# EAGLE design PCB-Logic-1.1-in-wall-IoT-Switch-Logic-Board (EAGLE 7.4.0)
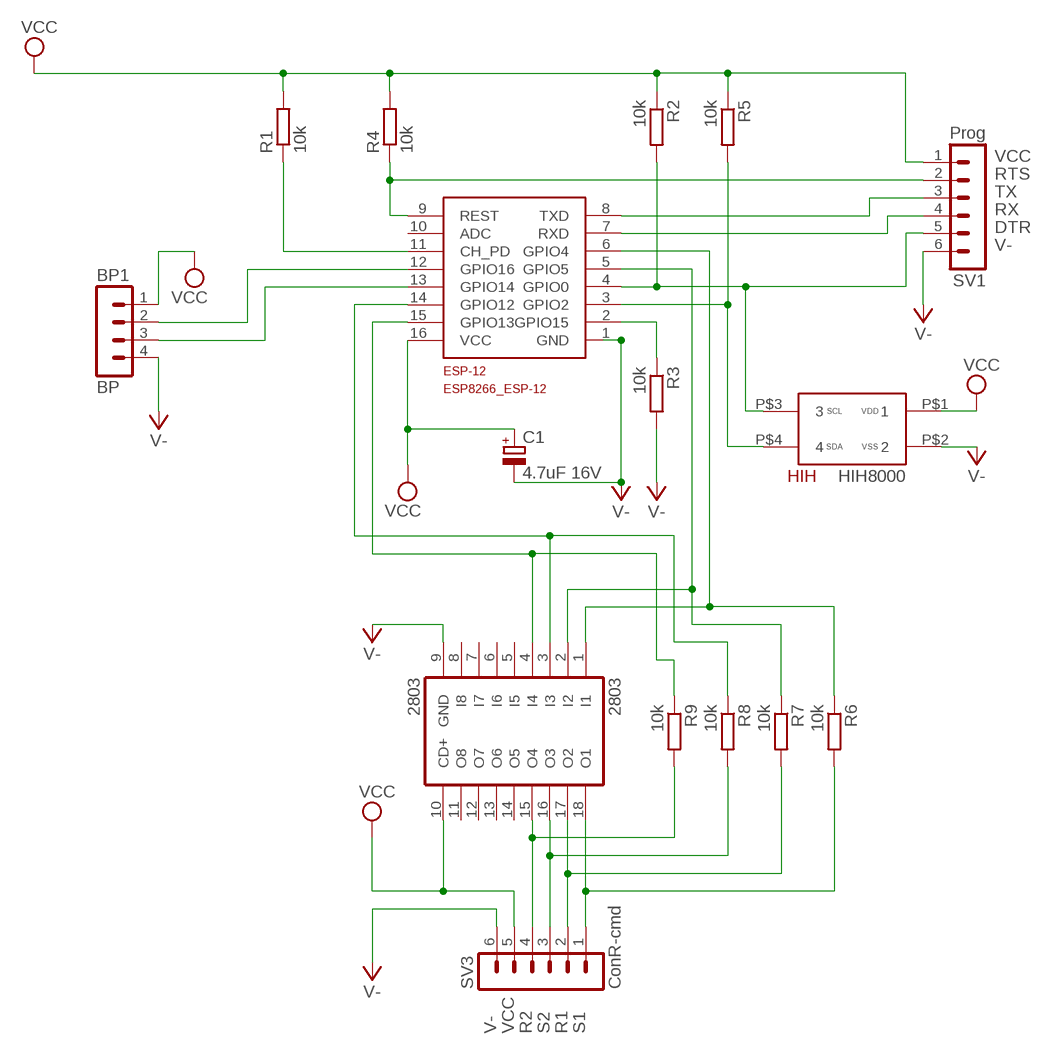
[diagram p0: schematic, sheet 1]

## Parts
2803  2803  ULN2803ADWADW  [SO18W]
BP  BP1  MA04-1  [MA04-1]
C1  4.7uF 16V  CPOL-EUA/3216-18W  [A/3216-18W]
ESP-12  ESP8266_ESP-12  [ESP8266-ESP12]
HIH  HIH8120-021-001  HIH8121-021-001  [SIP4]
R1  10k  R-EU_R1206W  [R1206W]
R2  10k  R-EU_R1206W  [R1206W]
R3  10k  R-EU_R1206W  [R1206W]
R4  10k  R-EU_R1206W  [R1206W]
R5  10k  R-EU_R1206W  [R1206W]
R6  10k  R-EU_R1206W  [R1206W]
R7  10k  R-EU_R1206W  [R1206W]
R8  10k  R-EU_R1206W  [R1206W]
R9  10k  R-EU_R1206W  [R1206W]
SV1  Prog  MA06-1  [MA06-1]
SV3  ConR-cmd  MA06-1  [MA06-1]

## Nets
BPDW: BP.3 ESP-12.13(GPIO14)
BPUP: BP.2 ESP-12.12(GPIO16)
DTR: ESP-12.4(GPIO0) HIH.P$3 R2.2 SV1.5
N$1: ESP-12.3(GPIO2) HIH.P$4 R5.2
N$2: ESP-12.2(GPIO15) R3.1
N$3: 2803.3(I3) ESP-12.14(GPIO12) R8.1
N$4: 2803.4(I4) ESP-12.15(GPIO13) R9.1
N$7: 2803.2(I2) ESP-12.5(GPIO5) R7.1
N$10: ESP-12.11(CH_PD) R1.1
N$17: 2803.1(I1) ESP-12.6(GPIO4) R6.1
R1: 2803.17(O2) R7.2 SV3.2
R2: 2803.15(O4) R9.2 SV3.4
RTS: ESP-12.9(REST) R4.1 SV1.2
RX: ESP-12.7(RXD) SV1.4
S1: 2803.18(O1) R6.2 SV3.1
S2: 2803.16(O3) R8.2 SV3.3
TX: ESP-12.8(TXD) SV1.3
V-: 2803.9(GND) BP.4 C1.- ESP-12.1(GND) HIH.P$2 R3.2 SV1.6 SV3.6
VCC: 2803.10(CD+) BP.1 C1.+ ESP-12.16(VCC) HIH.P$1 R1.2 R2.1 R4.2 R5.1 SV1.1 SV3.5
Unconnected: 2803.5(I5) 2803.6(I6) 2803.7(I7) 2803.8(I8) 2803.11(O8) 2803.12(O7) 2803.13(O6) 2803.14(O5) ESP-12.10(ADC)

## Library data of the parts
2803 = uln2803adw:ULN2803ADW: DRIVER ARRAY
BP = con-lstb:MA04-1: PIN HEADER; OC_FARNELL: unknown; OC_NEWARK: unknown
C1 = rcl:CPOL-EU: POLARIZED CAPACITOR, European symbol; REF: TAJA475K016RNJ
ESP-12 = ESP8266-ESP12:ESP8266_ESP-12
HIH = Honeywell-HumidIcon:HIH8121-021-001: I 2 C Communication with the Honeywell HumidIconTM Digital Humidity/Temperature Sensors
R1-R9 = rcl:R-EU_: RESISTOR, European symbol
SV1 SV3 = con-lstb:MA06-1: PIN HEADER; OC_FARNELL: unknown; OC_NEWARK: unknown

## Board
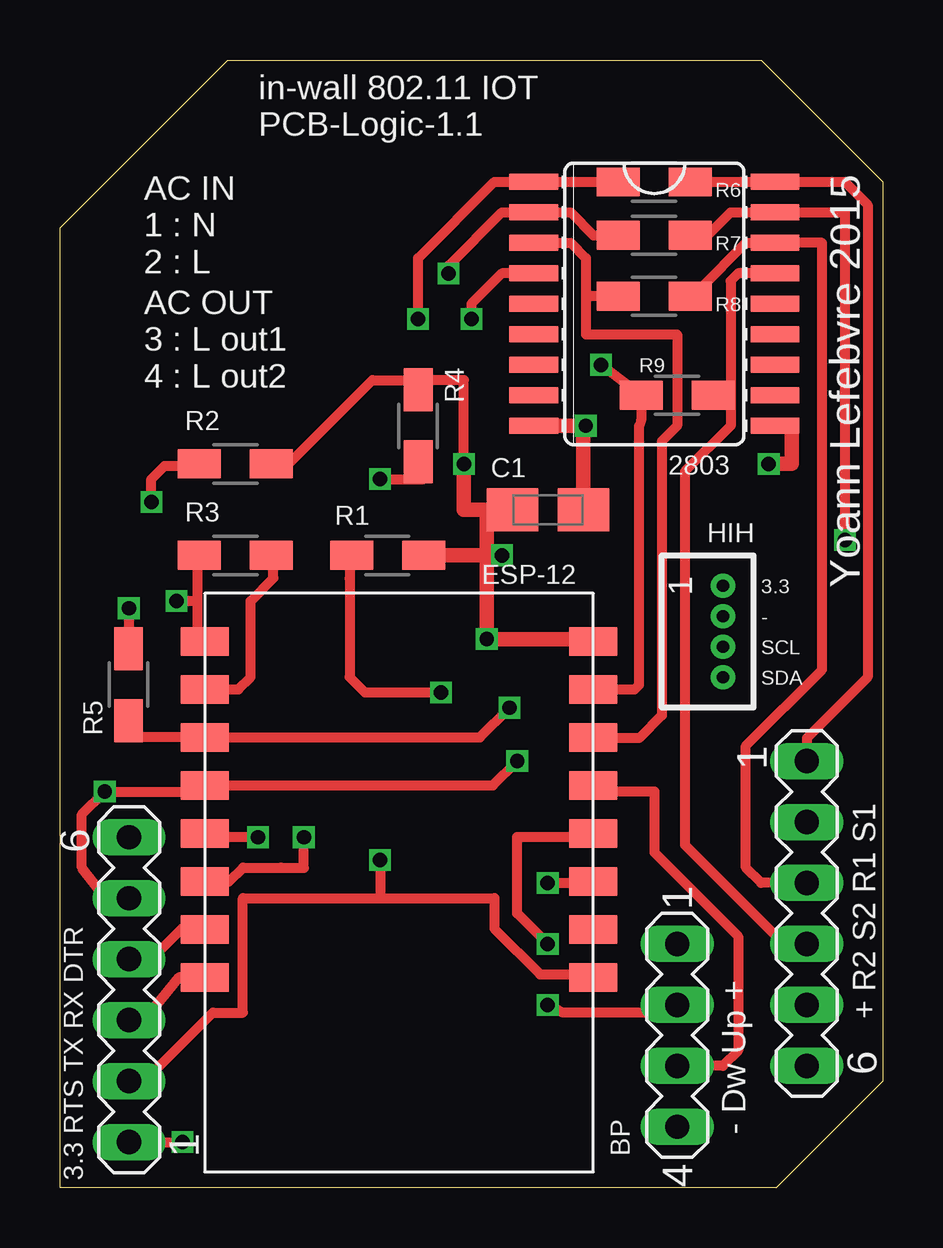
[diagram p1: board, top side]
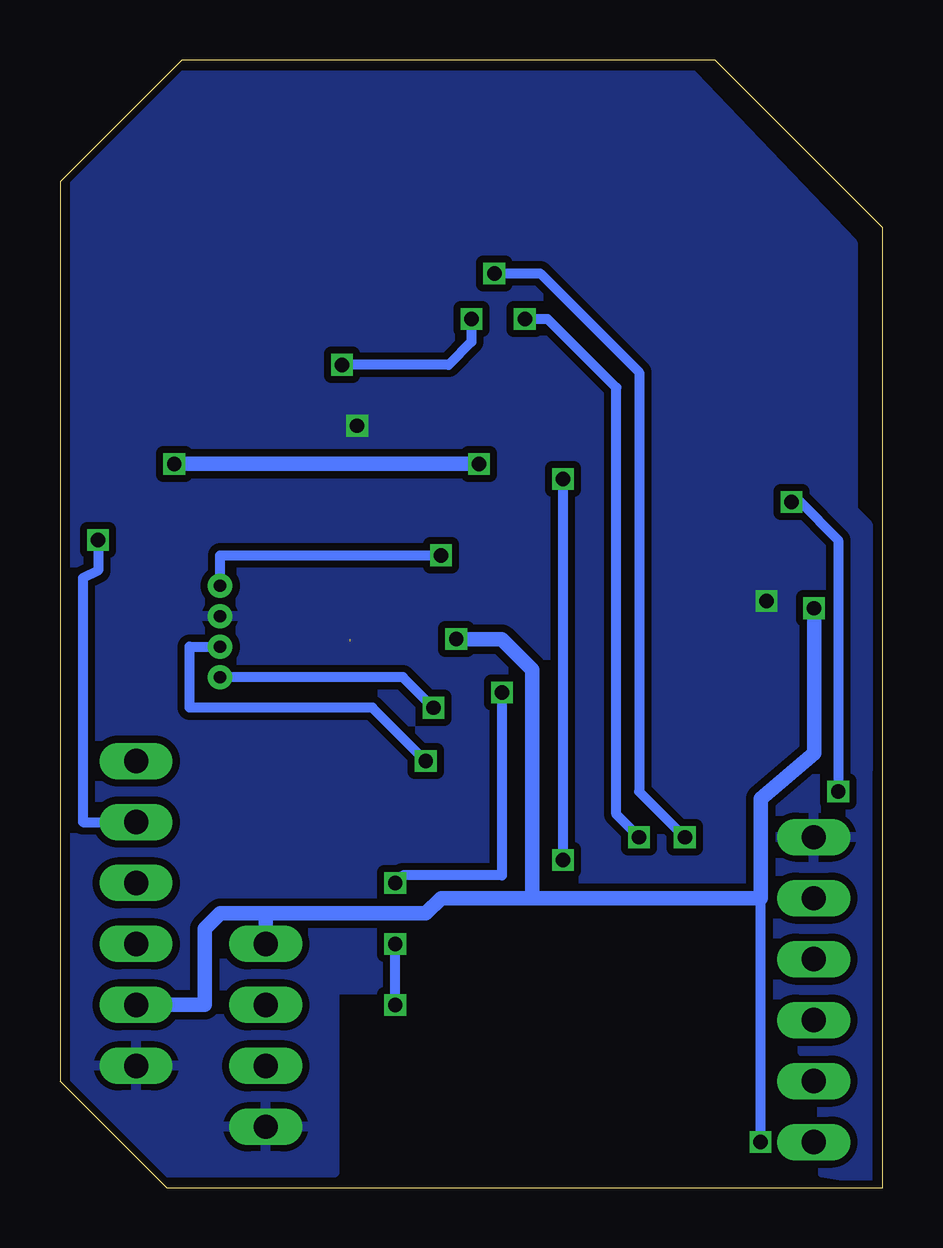
[diagram p2: board, bottom side, seen from below]

Size 34.29 x 46.99 mm. Coordinates in mm from the lower left corner, seen from the top.
Outline: 6.99,46.99 29.21,46.99 34.29,41.91 34.29,4.45 29.84,0 0,0 0,40.01 6.99,46.99
Copper layers (1*16): Top 0.035mm / dielectric 1.5mm / Bottom 0.035mm
Design rules "Elecrow_2-layer_eagle_rule": minimum track width 6mil, minimum drill 12mil, track to track 6mil, track to pad 6mil, pad to pad 6mil, via to via 6mil, smd to smd 0mil, copper to edge 10mil, drill to drill 10mil, minimum pad ring 10mil, minimum via ring 6mil, stop-mask expansion 2mil, vias tented up to drill 100mil, thermal gap 10mil

### Footprints (pad centres in the part's own frame; a part is rotated, then mirrored left to right if it is on the bottom)
SO18W = smd 0.66 x 2.032: 1 -5.08,-5.029; 2 -3.81,-5.029; 3 -2.54,-5.029; 4 -1.27,-5.029; 5 0,-5.029; 6 1.27,-5.029; 7 2.54,-5.029; 8 3.81,-5.029; 9 5.08,-5.029; 10 5.08,5.029; 11 3.81,5.029; 12 2.54,5.029; 13 1.27,5.029; 14 0,5.029; 15 -1.27,5.029; 16 -2.54,5.029; 17 -3.81,5.029; 18 -5.08,5.029
MA04-1 = drill 1.016 long: 1 -3.81,0; 2 -1.27,0; 3 1.27,0; 4 3.81,0
A/3216-18W = smd 2.15 x 1.8: + 1.475,0; - -1.475,0
ESP8266-ESP12 = smd 2 x 1.2: 1 16.2,2; 2 16.2,4; 3 16.2,6; 4 16.2,8; 5 16.2,10; 6 16.2,12; 7 16.2,14; 8 16.2,16; 9 0,16; 10 0,14; 11 0,12; 12 0,10; 13 0,8; 14 0,6; 15 0,4; 16 0,2
SIP4 = drill 0.508 pad 1.016: P$1 2.54,3.81; P$2 3.81,3.81; P$3 5.08,3.81; P$4 6.35,3.81
R1206W = smd 1.8 x 1.2: 1 -1.499,0; 2 1.499,0
MA06-1 = drill 1.016 long: 1 -6.35,0; 2 -3.81,0; 3 -1.27,0; 4 1.27,0; 5 3.81,0; 6 6.35,0

### Placement (x,y rotation side)
2803  24.77,36.83 270 top
BP  25.72,6.35 270 top
C1  20.33,28.25 180 top
ESP-12  22.23,24.77 180 top
HIH  23.81,27.62 270 top
R1  13.65,26.35 0 top
R2  7.3,30.16 180 top
R3  7.3,26.35 180 top
R4  14.92,31.75 90 top
R5  2.86,20.95 270 top
R6  24.77,41.91 0 top
R7  24.77,39.69 0 top
R8  24.77,37.15 0 top
R9  25.72,33.02 0 top
SV1  2.88,8.26 90 top
SV3  31.11,11.43 270 top

### Tracks (layer width: path | path; a pad name or v marks a point on that pad's centre or on a via)
BPDW
  Top 0.406: 21.59,16.51 ESP-12.13 22.86,16.51 24.77,16.51 24.77,13.97 28.26,10.48 28.26,5.71 27.62,5.08 BP.3
BPUP  (via drill 0.6)
  Top 0.406: ESP-12.12 22.23,14.61 19.05,14.61 19.05,11.43 v20.32,10.16 | BP.2 24.77,7.3 20.95,7.3 v20.32,7.62
  Bottom 0.406: v20.32,7.62 v20.32,10.16
DTR  (via drill 0.6)
  Top 0.406: SV1.5 1.91,12.06 0.91,13.34 0.91,15.56 v1.86,16.51 5.77,16.51 ESP-12.4 18.04,16.77 v19.05,17.78 | v3.81,28.57 3.81,29.53 4.36,30.07 5.08,30.07 R2.2
  Bottom 0.406: v3.81,28.57 3.49,28.62 1.86,26.99 v1.86,16.51 | v19.05,17.78 21.27,20 28.89,20 28.89,22.54 HIH.P$3
N$1  (via drill 0.6)
  Top 0.406: R5.2 3.23,18.77 ESP-12.3 17.5,18.77 v18.73,20
  Bottom 0.406: v18.73,20 20,21.27 HIH.P$4
N$2
  Top 0.406: ESP-12.2 7.43,20.77 7.94,21.27 7.94,24.45 8.89,25.4 8.89,26.26 R3.1
N$3
  Top 0.406: 2803.3 21.27,39.37 21.91,38.73 21.91,37.15 | 21.91,37.15 21.91,35.56 25.72,35.56 25.72,31.75 25.08,31.11 25.08,19.68 24.13,18.73 22.26,18.73 ESP-12.14 | R8.1 21.91,37.15
N$4  (via drill 0.6)
  Top 0.406: ESP-12.15 23.94,20.77 24.13,20.95 24.13,31.75 24.22,31.98 R9.1 v22.54,34.29 | 2803.4 18.41,38.1 17.14,36.83 v17.14,36.2
  Bottom 0.406: v17.14,36.2 17.14,35.24 18.1,34.29 v22.54,34.29
N$7  (via drill 0.6)
  Top 0.406: v8.26,14.61 6.18,14.61 ESP-12.5 | v16.19,38.1 16.19,38.42 18.41,40.64 2803.2 21.27,40.64 22.23,39.69 R7.1
  Bottom 0.406: v16.19,38.1 14.29,38.1 10.16,33.97 10.16,16.51 v8.26,14.61
N$10  (via drill 0.6)
  Top 0.406: R1.1 12.07,26.35 12.07,25.39 12.06,21.27 12.7,20.64 v15.88,20.64 | v20.32,12.7 22.16,12.7 ESP-12.11
  Bottom 0.406: v15.88,20.64 15.88,13.02 20,13.02 v20.32,12.7
N$17  (via drill 0.6)
  Top 0.406: ESP-12.6 7.05,12.77 7.62,13.34 9.21,13.34 10.16,13.33 v10.16,14.61 | v14.92,36.2 14.92,38.73 18.1,41.91 2803.1 R6.1
  Bottom 0.406: v10.16,14.61 11.11,15.56 11.11,33.34 13.97,36.2 v14.92,36.2
R1  (via drill 0.6)
  Top 0.406: v32.7,26.99 32.7,40.64 2803.17 27.94,40.64 26.99,39.69 R7.2
  Bottom 0.406: v32.7,26.99 32.7,25.72 33.34,25.4 33.34,15.24 SV3.2
R2
  Top 0.406: 2803.15 28.26,38.1 27.94,37.78 27.94,33.02 | 27.94,33.02 27.94,31.75 26.04,29.85 26.04,29.84 26.04,29.21 26.04,14.61 26.04,14.29 30.16,10.16 SV3.4 | 26.99,33.02 R9.2 27.94,33.02
RTS  (via drill 0.6)
  Top 0.406: SV1.2 3.51,4.45 6.37,7.3 7.62,7.3 7.62,12.06 13.34,12.06 | 13.34,12.06 18.1,12.06 18.1,10.79 20,8.89 22.1,8.89 ESP-12.9 | v13.34,13.65 13.34,12.06 | v13.34,29.53 15.15,29.53 R4.1
  Bottom 0.406: v13.34,29.53 v13.34,13.65
RX
  Top 0.406: SV1.4 3.81,9.53 5.08,10.79 6,10.79 ESP-12.7
S1
  Top 0.406: SV3.1 31.11,18.73 33.66,21.27 33.66,40.96 32.7,41.91 2803.18 R6.2
S2
  Top 0.406: SV3.3 29.21,12.7 28.57,13.34 28.57,18.41 31.75,21.59 31.75,39.37 2803.16 28.57,39.37 26.67,37.47 R8.2
TX
  Top 0.406: ESP-12.8 4.96,8.77 3.5,6.99 SV1.3
V-  (via drill 0.6)
  Top 0.406: 5.93,22.86 ESP-12.1 5.8,22.99 5.71,22.99 5.71,24.45 | R3.2 5.71,26.35 5.71,24.45 | 5.71,24.45 v4.85,24.45
  Top 0.61: 2803.9 v21.91,31.75 21.8,31.54 C1.-
  Bottom 0.406: v4.85,24.45 4.76,24.45
  pour Bottom (isolate 0.305): 0.64,17.84 0.65,16.88 0.65,0.32 2.54,0.64 2.54,4.45 5.08,8.26 22.86,8.26 22.86,0.64 29.84,0.64 33.66,4.45 33.66,41.91 29.21,46.35 7.93,46.35 1.26,39.37 1.26,28.27 0.64,27.64
VCC  (via drill 0.6)  (1 unrouted)
  Top 0.406: 2803.10 30.48,31.75 | SV1.1 v5.1,1.91 | v16.83,30.16 16.83,33.66 15.33,33.66 R4.2 15.24,33.66 13.02,33.66 9.53,30.16 R2.1 | v2.87,24.14 2.86,24.16 R5.1 | C1.+ 17.79,28.25 17.78,28.26 | v18.41,26.35 17.78,26.35
  Top 0.61: R1.2 17.78,26.35 | 30.48,31.75 30.48,30.16 v29.53,30.16 | v16.83,30.16 16.83,28.26 17.78,28.26 17.78,26.35 | 17.78,26.35 v17.78,22.86 22.23,22.86
  Bottom 0.406: v5.1,1.91 5.1,12.06 | HIH.P$1 27.62,26.35 v18.41,26.35
  Bottom 0.61: v29.53,30.16 v16.83,30.16 | 25.72,11.43 19.05,11.43 18.41,12.06 14.61,12.06 | 25.72,11.43 27.62,11.43 28.26,10.79 28.26,7.62 SV3.5 | v2.87,24.14 2.87,18.11 5.1,16.21 5.1,12.06 14.61,12.06 | v17.78,22.86 15.88,22.86 14.61,21.59 14.61,12.06 | BP.1 25.72,11.43

### Text on the board
tNames: in-wall 802.11 IOT / PCB-Logic-1.1 | Yoann Lefebvre 2015 | AC IN / 1 : N / 2 : L | AC OUT / 3 : L out1 / 4 : L out2 | 3.3 | - | SCL | SDA | + R2 S2 R1 S1 | - Dw Up + | 3.3 RTS TX RX DTR